# Altium project HCMS_Project.PrjPcb
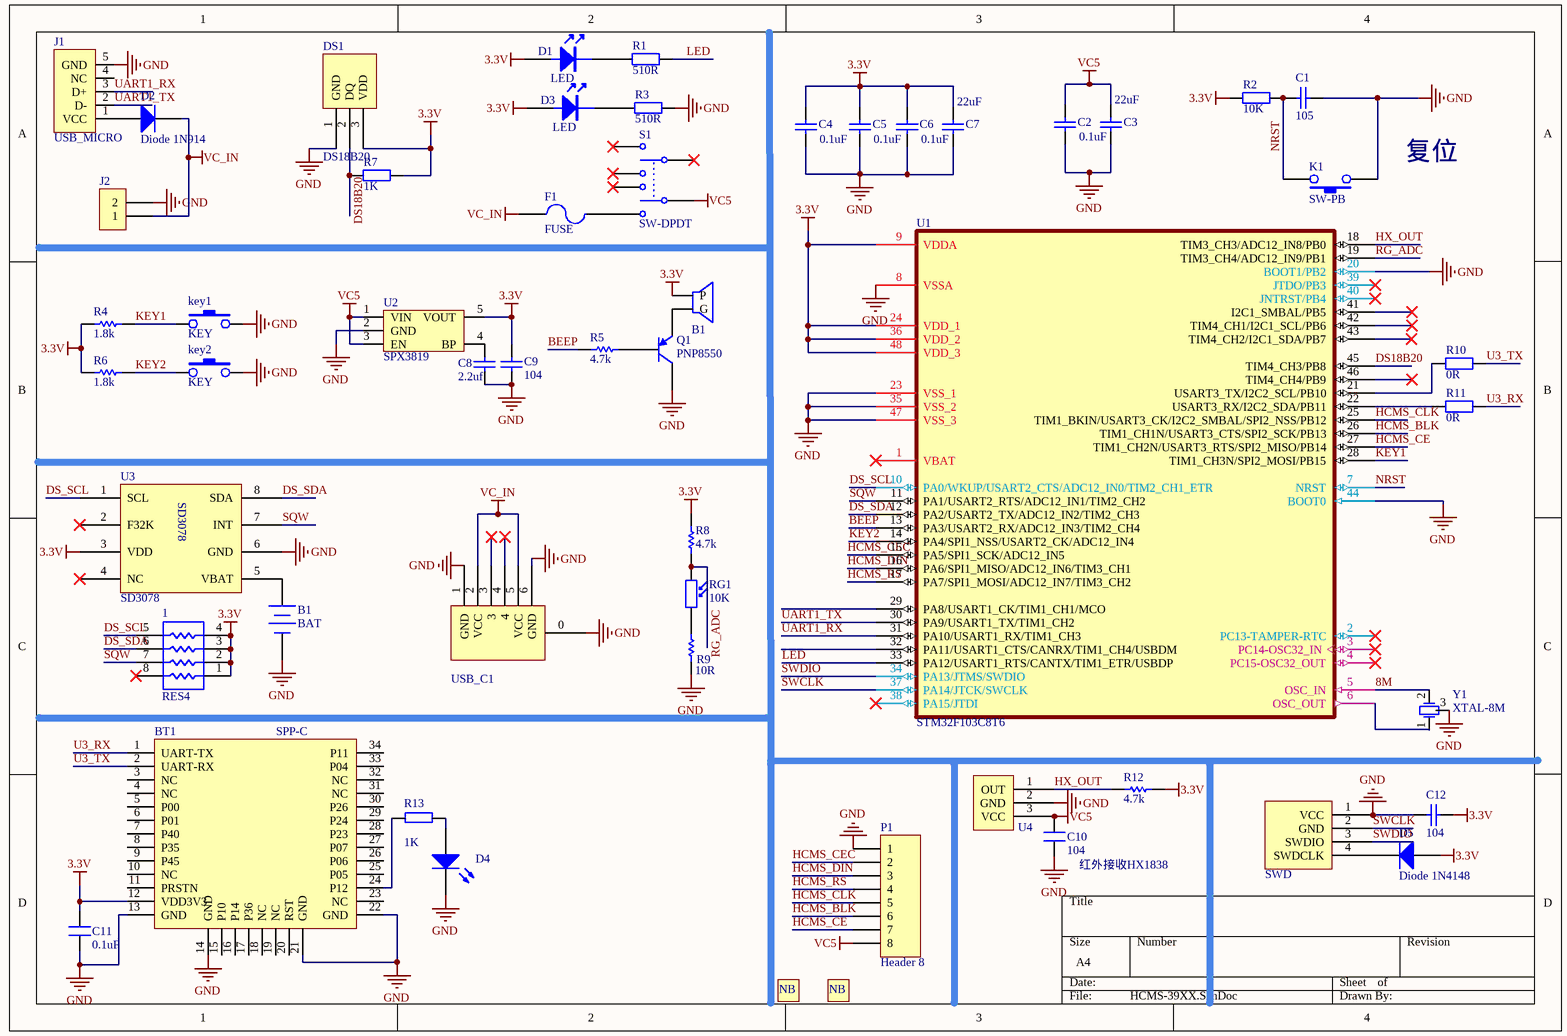
[diagram p0: HCMS-39XX.SchDoc]
1 sheet, 54 parts. Net scope: global (net labels, ports and power ports of the same name join across sheets).
Board file: HCMS-39XX.PcbDoc

## Sheet HCMS-39XX.SchDoc
size A4

### Parts
(Parts that share a designator on the sheet are numbered #1, #2 ... from top to bottom, then left to right.)
1  RES4  [0603RES]
B1#1  BEEP  [BELL-SMALL]  (value not drawn)
B1#2  BAT  [Batary-Li]
BT1  SPP-C  [CC2540/2541]
C1  105  [0603C]
C2  value 0.1uF  [0603C]  (hidden comment: Cap)
C3  value 22uF  [0603C]  (hidden comment: Cap)
C4  value 0.1uF  [0603C]  (hidden comment: Cap)
C5  value 0.1uF  [0603C]  (hidden comment: Cap)
C6  value 0.1uF  [0603C]  (hidden comment: Cap)
C7  value 22uF  [0603C]  (hidden comment: Cap)
C8  value 2.2uf  [0603C]  (hidden comment: Cap)
C9  value 104  [0603C]  (hidden comment: Cap)
C10  104  [0603C]
C11  value 0.1uF  [0603C]
C12  104  [0603C]
D1  LED  [LED 0805B]
D2  Diode 1N914  [DO-213AA]
D3  LED  [LED 0603R]
D4  LED0  [LED 0603B]  (value not drawn)
D5  Diode 1N4148  [SOD-323]
DS1  DS18B20  [HDR-1X3]
F1  FUSE  [FU 0805]
J1  USB_MICRO  [Micro_USB]
J2  CON2  [HDR-1X2]  (value not drawn)
K1  SW-PB  [KEY_M]
key1  KEY  [TSW DIP-6*6*7_V]
key2  KEY  [TSW DIP-6*6*7_V]
P1  Header 8  [connect-8PB]
picture1  图标  [Raptor]  (value not drawn)
picture2  图标  [LCL_TS]  (value not drawn)
Q1  PNP8550  [NPN8050 SOT23R]
R1  510R  [0603R]
R2  10K  [0603R]
R3  510R  [0603R]
R4  1.8k  [0603R]
R5  4.7k  [0603R]
R6  1.8k  [0805R]
R7  value 1K  [0603R]  (hidden comment: Res1)
R8  4.7k  [0603R]
R9  10R  [0603R]
R10  0R  [0805R]
R11  0R  [0805R]
R12  4.7k  [0603R]
R13  value 1K  [0603R]
RG1  10K  [RG5528]
S1  SW-DPDT  [SWitch - duplicate1]
SWD1  SWD  [MOLEX 537800470]
U1  STM32F103C8T6  [LQFP48 7X7_L]
U2  SPX3819  [SOT23-5N]
U3  SD3078  [SOP8W_L]
U4  红外接收HX1838  [红外HX1838]
USB_C1  USB-C_6P  [typec]  (value not drawn)
Y1  XTAL-8M  [XTAL_8M]

### Nets
3.3V: 1.1 1.2 1.3 1.4 B1#1.1(P) BT1.12(VDD3V3) C4.2 C5.2 C6.2 C7.2 C9.2 C11.2 C12.2 D1.1 D3.1 D5.1(A) DS1.3(VDD) R2.2 R4.1 R6.1 R7.2 R8.1 R12.2 U1.9(VDDA) U1.24(VDD_1) U1.36(VDD_2) U1.48(VDD_3) U2.5(VOUT) U3.3(VDD)
GND: B1#2.2(-) BT1.13(GND) BT1.14(GND) BT1.21(GND) BT1.22(GND) C1.1 C2.1 C3.1 C4.1 C5.1 C6.1 C7.1 C8.1 C9.1 C10.1 C11.1 C12.1 D4.2(K) DS1.1(GND) J1.5(GND) J2.2 K1.1 key1.2 key2.2 P1.1 Q1.3(C) R3.2 R9.2 SWD1.1(VCC) U1.8(VSSA) U1.20(BOOT1/PB2) U1.23(VSS_1) U1.35(VSS_2) U1.44(BOOT0) U1.47(VSS_3) U2.2(GND) U3.6(GND) U4.2(GND) USB_C1.0 USB_C1.1(GND) USB_C1.6(GND) Y1.3
VC5: C2.2 C3.2 C10.2 P1.8 S1.2 U2.1(VIN) U2.3(EN) U4.3(VCC)
VC_IN: D2.2(K) F1.2 J2.1 USB_C1.2(VCC) USB_C1.5(VCC)
8M: U1.5(OSC_IN) Y1.2(OSC2)
BEEP: R5.1 U1.13(PA3/USART2_RX/ADC12_IN3/TIM2_CH4)
DS18B20: DS1.2(DQ) R7.1 U1.45(TIM4_CH3/PB8)
DS_SCL: 1.5 U1.10(PA0/WKUP/USART2_CTS/ADC12_IN0/TIM2_CH1_ETR) U3.1(SCL)
DS_SDA: 1.6 U1.12(PA2/USART2_TX/ADC12_IN2/TIM2_CH3) U3.8(SDA)
HCMS_BLK: P1.6 U1.26(TIM1_CH1N/USART3_CTS/SPI2_SCK/PB13)
HCMS_CE: P1.7 U1.27(TIM1_CH2N/USART3_RTS/SPI2_MISO/PB14)
HCMS_CEC: P1.2 U1.15(PA5/SPI1_SCK/ADC12_IN5)
HCMS_CLK: P1.5 U1.25(TIM1_BKIN/USART3_CK/I2C2_SMBAL/SPI2_NSS/PB12)
HCMS_DIN: P1.3 U1.16(PA6/SPI1_MISO/ADC12_IN6/TIM3_CH1)
HCMS_RS: P1.4 U1.17(PA7/SPI1_MOSI/ADC12_IN7/TIM3_CH2)
HX_OUT: R12.1 U1.18(TIM3_CH3/ADC12_IN8/PB0) U4.1(OUT)
KEY1: key1.1 R4.2 U1.28(TIM1_CH3N/SPI2_MOSI/PB15)
KEY2: key2.1 R6.2 U1.14(PA4/SPI1_NSS/USART2_CK/ADC12_IN4)
LED: R1.2 U1.33(PA12/USART1_RTS/CANTX/TIM1_ETR/USBDP)
NRST: C1.2 K1.2 R2.1 U1.7(NRST)
RG_ADC: R8.2 RG1.1 U1.19(TIM3_CH4/ADC12_IN9/PB1)
SQW: 1.7 U1.11(PA1/USART2_RTS/ADC12_IN1/TIM2_CH2) U3.7(INT)
SWCLK: SWD1.2(GND) U1.37(PA14/JTCK/SWCLK)
SWDIO: SWD1.3(SWDIO) U1.34(PA13/JTMS/SWDIO)
U3_RX: BT1.1(UART-TX) R11.2
U3_TX: BT1.2(UART-RX) R10.2
UART1_RX: J1.3(D+) U1.31(PA10/USART1_RX/TIM1_CH3)
UART1_TX: J1.2(D-) U1.30(PA9/USART1_TX/TIM1_CH2)
NetB1#1_2: B1#1.2(G) Q1.2(E)
NetB1#2_1: B1#2.1(+) U3.5(VBAT)
NetBT1_24: BT1.24(P12) R13.2
NetC8_2: C8.2 U2.4(BP)
NetD1_2: D1.2 R1.1
NetD2_1: D2.1(A) J1.1(VCC)
NetD3_2: D3.2 R3.1
NetD4_1: D4.1(A) R13.1
NetD5_2: D5.2(K) SWD1.4(SWDCLK)
NetF1_1: F1.1 S1.1
NetQ1_1: Q1.1(B) R5.2
NetR9_1: R9.1 RG1.2
NetR10_1: R10.1 U1.21(USART3_TX/I2C2_SCL/PB10)
NetR11_1: R11.1 U1.22(USART3_RX/I2C2_SDA/PB11)
NetU1_6: U1.6(OSC_OUT) Y1.1(OSC1)

Not connected (* = marked no-connect by the designer): 1 8*; BT1 3(NC) 4(NC) 5(P00) 6(P01) 7(P40) 8(P35) 9(P45) 10(NC) 11(PRSTN) 15(P10) 16(P14) 17(P36) 18(NC) 19(NC) 20(RST) 23(NC) 25(P05) 26(P06) 27(P07) 28(P23) 29(P24) 30(P26) 31(NC) 32(NC) 33(P04) 34(P11); J1 4(NC); S1 3* 4(5)* 5(4)*; U1 1(VBAT)* 2(PC13-TAMPER-RTC)* 3(PC14-OSC32_IN)* 4(PC15-OSC32_OUT)* 29(PA8/USART1_CK/TIM1_CH1/MCO) 32(PA11/USART1_CTS/CANRX/TIM1_CH4/USBDM) 38(PA15/JTDI)* 39(JTDO/PB3)* 40(JNTRST/PB4)* 41(I2C1_SMBAL/PB5)* 42(TIM4_CH1/I2C1_SCL/PB6)* 43(TIM4_CH2/I2C1_SDA/PB7)* 46(TIM4_CH4/PB9)*; U3 2(F32K)* 4(NC)*; USB_C1 3* 4*

### Notes on the sheet
- 复位
- (in symbol SP) NB

### Library data of the parts
BT1 = SPP-C: sppc
C1 = Cap: Capacitor; Value: 104; Published: 8-Jun-2000; LatestRevisionDate: 17-Jul-2002; LatestRevisionNote: Re-released for DXP Platform.; Publisher: Altium Limited
C2-C7 C12 = Cap: Capacitor; Published: 8-Jun-2000; LatestRevisionDate: 17-Jul-2002; LatestRevisionNote: Re-released for DXP Platform.; Publisher: Altium Limited
  C2-C7: PackageReference: RAD-0.3
  C12: Value: 104
C8 C9 = Cap: Polarized Capacitor (Radial); Published: 8-Jun-2000; Revision: July-2002: Re-released for DXP Platform.; Publisher: Altium Limited
C10 = 0603C
C11 = C
D2 = Diode 1N914: High Conductance Fast Diode; Published: 8-Jun-2000; LatestRevisionDate: 17-Jul-2002; LatestRevisionNote: Re-released for DXP Platform.; DatasheetVersion: 1997; PackageReference: DO-35; Publisher: Altium Limited; PackageDescription: Diode, Axial; Body 3.8 x 1.9 mm (LxDia. max), Lead Dia. 0.53 mm (max); Code_JEDEC: DO-204-AH; ComponentLink1Description: Manufacturer Link; ComponentLink1URL: http://www.fairchildsemi.com/; ComponentLink2Description: Datasheet; ComponentLink2URL: http://www.fairchildsemi.com/ds/1N%2F1N4448.pdf
D4 = LED0: Typical INFRARED GaAs LED; Published: 8-Jun-2000; LatestRevisionDate: 08-Jul-2005; LatestRevisionNote: Mech Layer 1 removed.; PackageReference: LED-0; Publisher: Altium Limited
D5 = Diode 1N4148: High Conductance Fast Diode; Published: 8-Jun-2000; LatestRevisionDate: 17-Jul-2002; LatestRevisionNote: Re-released for DXP Platform.; DatasheetVersion: 1997; PackageReference: DO-35; Publisher: Altium Limited; PackageDescription: Diode, Axial; Body 3.8 x 1.9 mm (LxDia. max), Lead Dia. 0.53 mm (max); Code_JEDEC: DO-204-AH; ComponentLink1Description: Manufacturer Link; ComponentLink1URL: http://www.fairchildsemi.com/; ComponentLink2Description: Datasheet; ComponentLink2URL: http://www.fairchildsemi.com/ds/1N%2F1N4148.pdf
DS1 = DS18B20: 温度传感器
J2 = CON2: Connector
P1 = Header 8: Header, 8-Pin; LatestRevisionDate: 17-Jul-2002; LatestRevisionNote: Re-released for DXP Platform.; Publisher: Altium Limited
picture1 picture2 = SP
R1-R3 R10 R11 = Res2: Resistor; Published: 8-Jun-2000; LatestRevisionDate: 17-Jul-2002; LatestRevisionNote: Re-released for DXP Platform.; Publisher: Altium Limited
R4-R6 R8 R9 R12 = 0603r
R7 = Res1: 贴片电阻; Published: 8-Jun-2000; LatestRevisionDate: 17-Jul-2002; LatestRevisionNote: Re-released for DXP Platform.; PackageReference: AXIAL-0.4; Publisher: Altium Limited
R13 = R_1
RG1 = RG5528: 光敏电阻; 版权归属: 源创客; BOM名称: 光敏电阻; 学习资源: www.ooocke.com
S1 = SW-DPDT: Double-Pole, Double-Throw Switch; Published: 24-Mar-1999; LatestRevisionDate: 17-Jul-2002; LatestRevisionNote: Re-released for DXP Platform.; PackageReference: DPDT-6; Publisher: Altium Limited; PackageDescription: Switch; 6 Leads
U1 = STM32F103C8T6: STM32 ARM-based 32-bit MCU with 64 Kbytes Flash, 48-pin LQFP, Industrial Temperature; Published: *; DatasheetVersion: *; PackageVersion: *; PackageReference: *; Publisher: *; PackageDescription: *; ComponentLink1Description: *; ComponentLink1URL: *; ComponentLink2Description: *; ComponentLink2URL: *
U2 = RT9193-33: 3.3V超低压差LDO
USB_C1 = USB-C_6P: 贴片Type_C接口